# Altium project PCB-Tester-Board-V1.PrjPcb (part 4 of 4)

## Sheet PowerRouting.SchDoc: PCB-Tester Power Routing
size A4; Date: JUN 2020; CheckedBy: Moerz, Hoeren; Author: Rudziński; CompanyName: TDK-Micronas GmbH; DrawnBy: Rudziński; Engineer: Rudziński; Organization: Test Engineering; Address1: Hans-Bunte-Strasse 19; Address2: D-79108 Freiburg; Address3: Germany; DocumentNumber: U33110; Revision: V1.0; SheetNumber: 16; SheetTotal: 18; DateDraw: JUN 2020; DateChecked: 2020-06-19; Workspace: Workspace; TitleTyp: Title-Typ; PageSetup: Record=PageOptions|CenterHorizontal=True|CenterVertical=True|PrintScale=0.97|XCorrection=1.00|YCorrection=1.00|PrintKind=0|BorderSize=5000000|LeftOffset=0|BottomOffset=0|Orientation=2|PaperLength=1000|PaperWidth=1000|Scale=100|PaperSource=7|PrintQuality=-3|MediaType=1|DitherType=10|PrintScaleMode=1|PaperKind=A4|PaperIndex=9
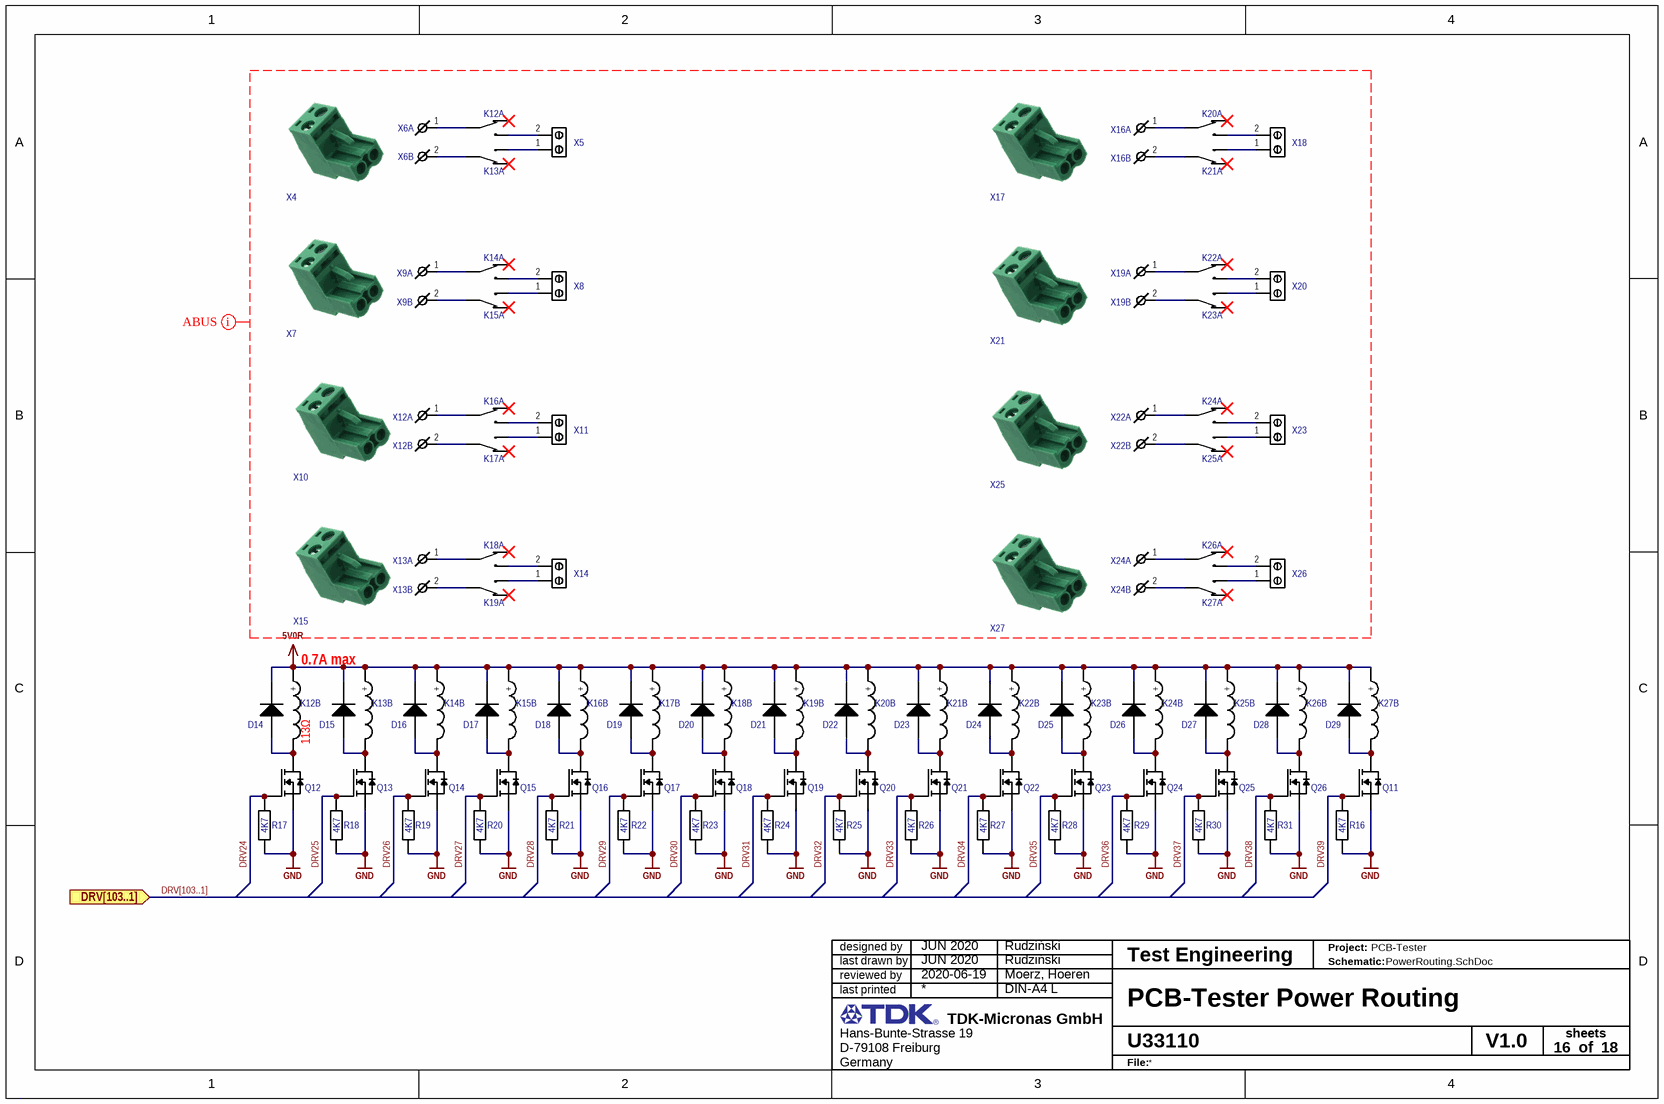
[diagram p16: PowerRouting.SchDoc]

### Parts
D14  D  [SOD123]  (value not drawn)
D15  D  [SOD123]  (value not drawn)
D16  D  [SOD123]  (value not drawn)
D17  D  [SOD123]  (value not drawn)
D18  D  [SOD123]  (value not drawn)
D19  D  [SOD123]  (value not drawn)
D20  D  [SOD123]  (value not drawn)
D21  D  [SOD123]  (value not drawn)
D22  D  [SOD123]  (value not drawn)
D23  D  [SOD123]  (value not drawn)
D24  D  [SOD123]  (value not drawn)
D25  D  [SOD123]  (value not drawn)
D26  D  [SOD123]  (value not drawn)
D27  D  [SOD123]  (value not drawn)
D28  D  [SOD123]  (value not drawn)
D29  D  [SOD123]  (value not drawn)
K12  K  [HF118F005-1ZS1]  (value not drawn)  (parts A,B of 2)
K13  K  [HF118F005-1ZS1]  (value not drawn)  (parts A,B of 2)
K14  K  [HF118F005-1ZS1]  (value not drawn)  (parts A,B of 2)
K15  K  [HF118F005-1ZS1]  (value not drawn)  (parts A,B of 2)
K16  K  [HF118F005-1ZS1]  (value not drawn)  (parts A,B of 2)
K17  K  [HF118F005-1ZS1]  (value not drawn)  (parts A,B of 2)
K18  K  [HF118F005-1ZS1]  (value not drawn)  (parts A,B of 2)
K19  K  [HF118F005-1ZS1]  (value not drawn)  (parts A,B of 2)
K20  K  [HF118F005-1ZS1]  (value not drawn)  (parts A,B of 2)
K21  K  [HF118F005-1ZS1]  (value not drawn)  (parts A,B of 2)
K22  K  [HF118F005-1ZS1]  (value not drawn)  (parts A,B of 2)
K23  K  [HF118F005-1ZS1]  (value not drawn)  (parts A,B of 2)
K24  K  [HF118F005-1ZS1]  (value not drawn)  (parts A,B of 2)
K25  K  [HF118F005-1ZS1]  (value not drawn)  (parts A,B of 2)
K26  K  [HF118F005-1ZS1]  (value not drawn)  (parts A,B of 2)
K27  K  [HF118F005-1ZS1]  (value not drawn)  (parts A,B of 2)
Q11  Q  [SOT23-3]  (value not drawn)
Q12  Q  [SOT23-3]  (value not drawn)
Q13  Q  [SOT23-3]  (value not drawn)
Q14  Q  [SOT23-3]  (value not drawn)
Q15  Q  [SOT23-3]  (value not drawn)
Q16  Q  [SOT23-3]  (value not drawn)
Q17  Q  [SOT23-3]  (value not drawn)
Q18  Q  [SOT23-3]  (value not drawn)
Q19  Q  [SOT23-3]  (value not drawn)
Q20  Q  [SOT23-3]  (value not drawn)
Q21  Q  [SOT23-3]  (value not drawn)
Q22  Q  [SOT23-3]  (value not drawn)
Q23  Q  [SOT23-3]  (value not drawn)
Q24  Q  [SOT23-3]  (value not drawn)
Q25  Q  [SOT23-3]  (value not drawn)
Q26  Q  [SOT23-3]  (value not drawn)
R16  value 4K7  [R0603 Reflow]  (hidden comment: R)
R17  value 4K7  [R0603 Reflow]  (hidden comment: R)
R18  value 4K7  [R0603 Reflow]  (hidden comment: R)
R19  value 4K7  [R0603 Reflow]  (hidden comment: R)
R20  value 4K7  [R0603 Reflow]  (hidden comment: R)
R21  value 4K7  [R0603 Reflow]  (hidden comment: R)
R22  value 4K7  [R0603 Reflow]  (hidden comment: R)
R23  value 4K7  [R0603 Reflow]  (hidden comment: R)
R24  value 4K7  [R0603 Reflow]  (hidden comment: R)
R25  value 4K7  [R0603 Reflow]  (hidden comment: R)
R26  value 4K7  [R0603 Reflow]  (hidden comment: R)
R27  value 4K7  [R0603 Reflow]  (hidden comment: R)
R28  value 4K7  [R0603 Reflow]  (hidden comment: R)
R29  value 4K7  [R0603 Reflow]  (hidden comment: R)
R30  value 4K7  [R0603 Reflow]  (hidden comment: R)
R31  value 4K7  [R0603 Reflow]  (hidden comment: R)
X4  X  [691352710002]  (value not drawn)
X5  X  [1731721]  (value not drawn)
X6  X  [691312710002]  (value not drawn)  (parts A,B of 2)
X7  X  [691352710002]  (value not drawn)
X8  X  [1731721]  (value not drawn)
X9  X  [691312710002]  (value not drawn)  (parts A,B of 2)
X10  X  [691352710002]  (value not drawn)
X11  X  [1731721]  (value not drawn)
X12  X  [691312710002]  (value not drawn)  (parts A,B of 2)
X13  X  [691312710002]  (value not drawn)  (parts A,B of 2)
X14  X  [1731721]  (value not drawn)
X15  X  [691352710002]  (value not drawn)
X16  X  [691312710002]  (value not drawn)  (parts A,B of 2)
X17  X  [691352710002]  (value not drawn)
X18  X  [1731721]  (value not drawn)
X19  X  [691312710002]  (value not drawn)  (parts A,B of 2)
X20  X  [1731721]  (value not drawn)
X21  X  [691352710002]  (value not drawn)
X22  X  [691312710002]  (value not drawn)  (parts A,B of 2)
X23  X  [1731721]  (value not drawn)
X24  X  [691312710002]  (value not drawn)  (parts A,B of 2)
X25  X  [691352710002]  (value not drawn)
X26  X  [1731721]  (value not drawn)
X27  X  [691352710002]  (value not drawn)

### Ports
DRV[103..1] (in)

### Nets
5V0R: D14.2(C) D15.2(C) D16.2(C) D17.2(C) D18.2(C) D19.2(C) D20.2(C) D21.2(C) D22.2(C) D23.2(C) D24.2(C) D25.2(C) D26.2(C) D27.2(C) D28.2(C) D29.2(C) K12.1(+) K13.1(+) K14.1(+) K15.1(+) K16.1(+) K17.1(+) K18.1(+) K19.1(+) K20.1(+) K21.1(+) K22.1(+) K23.1(+) K24.1(+) K25.1(+) K26.1(+) K27.1(+)
GND: Q11.2(S) Q12.2(S) Q13.2(S) Q14.2(S) Q15.2(S) Q16.2(S) Q17.2(S) Q18.2(S) Q19.2(S) Q20.2(S) Q21.2(S) Q22.2(S) Q23.2(S) Q24.2(S) Q25.2(S) Q26.2(S) R16.1 R17.1 R18.1 R19.1 R20.1 R21.1 R22.1 R23.1 R24.1 R25.1 R26.1 R27.1 R28.1 R29.1 R30.1 R31.1
DRV24: Q12.1(G) R17.2
DRV25: Q13.1(G) R18.2
DRV26: Q14.1(G) R19.2
DRV27: Q15.1(G) R20.2
DRV28: Q16.1(G) R21.2
DRV29: Q17.1(G) R22.2
DRV30: Q18.1(G) R23.2
DRV31: Q19.1(G) R24.2
DRV32: Q20.1(G) R25.2
DRV33: Q21.1(G) R26.2
DRV34: Q22.1(G) R27.2
DRV35: Q23.1(G) R28.2
DRV36: Q24.1(G) R29.2
DRV37: Q25.1(G) R30.2
DRV38: Q26.1(G) R31.2
DRV39: Q11.1(G) R16.2
NetD14_1: D14.1(A) K12.5(-) Q12.3(D)
NetD15_1: D15.1(A) K13.5(-) Q13.3(D)
NetD16_1: D16.1(A) K14.5(-) Q14.3(D)
NetD17_1: D17.1(A) K15.5(-) Q15.3(D)
NetD18_1: D18.1(A) K16.5(-) Q16.3(D)
NetD19_1: D19.1(A) K17.5(-) Q17.3(D)
NetD20_1: D20.1(A) K18.5(-) Q18.3(D)
NetD21_1: D21.1(A) K19.5(-) Q19.3(D)
NetD22_1: D22.1(A) K20.5(-) Q20.3(D)
NetD23_1: D23.1(A) K21.5(-) Q21.3(D)
NetD24_1: D24.1(A) K22.5(-) Q22.3(D)
NetD25_1: D25.1(A) K23.5(-) Q23.3(D)
NetD26_1: D26.1(A) K24.5(-) Q24.3(D)
NetD27_1: D27.1(A) K25.5(-) Q25.3(D)
NetD28_1: D28.1(A) K26.5(-) Q26.3(D)
NetD29_1: D29.1(A) K27.5(-) Q11.3(D)
NetK12_2: K12.2(Cin) X6.1(+)
NetK12_3: K12.3(Cno) X5.2
NetK13_2: K13.2(Cin) X6.2(-)
NetK13_3: K13.3(Cno) X5.1
NetK14_2: K14.2(Cin) X9.1(+)
NetK14_3: K14.3(Cno) X8.2
NetK15_2: K15.2(Cin) X9.2(-)
NetK15_3: K15.3(Cno) X8.1
NetK16_2: K16.2(Cin) X12.1(+)
NetK16_3: K16.3(Cno) X11.2
NetK17_2: K17.2(Cin) X12.2(-)
NetK17_3: K17.3(Cno) X11.1
NetK18_2: K18.2(Cin) X13.1(+)
NetK18_3: K18.3(Cno) X14.2
NetK19_2: K19.2(Cin) X13.2(-)
NetK19_3: K19.3(Cno) X14.1
NetK20_2: K20.2(Cin) X16.1(+)
NetK20_3: K20.3(Cno) X18.2
NetK21_2: K21.2(Cin) X16.2(-)
NetK21_3: K21.3(Cno) X18.1
NetK22_2: K22.2(Cin) X19.1(+)
NetK22_3: K22.3(Cno) X20.2
NetK23_2: K23.2(Cin) X19.2(-)
NetK23_3: K23.3(Cno) X20.1
NetK24_2: K24.2(Cin) X22.1(+)
NetK24_3: K24.3(Cno) X23.2
NetK25_2: K25.2(Cin) X22.2(-)
NetK25_3: K25.3(Cno) X23.1
NetK26_2: K26.2(Cin) X24.1(+)
NetK26_3: K26.3(Cno) X26.2
NetK27_2: K27.2(Cin) X24.2(-)
NetK27_3: K27.3(Cno) X26.1

Not connected (* = marked no-connect by the designer): K12 4(Cnc)*; K13 4(Cnc)*; K14 4(Cnc)*; K15 4(Cnc)*; K16 4(Cnc)*; K17 4(Cnc)*; K18 4(Cnc)*; K19 4(Cnc)*; K20 4(Cnc)*; K21 4(Cnc)*; K22 4(Cnc)*; K23 4(Cnc)*; K24 4(Cnc)*; K25 4(Cnc)*; K26 4(Cnc)*; K27 4(Cnc)*

### Buses and harness runs
bus DRV[103..1] = port DRV[103..1]

### Layout directives
net class ABUS: (no net found under the mark)

### Notes on the sheet
- 0.7A max
- designed by
- reviewed by
- last drawn by
- Project:
- Schematic:
- last printed
- DIN-A4 L
- sheets
- of
- File:

### Library data of the parts
D14-D29 = 1N4148W: DIODE GEN PURP 100V 300MA SOD123; 04. Manufacturer: Diodes Incorporated; 07. Manufacturer  Part Number: 1N4148W-7-F; 03. Unit Price: 0.14; 01. Distributor: DigiKey; 02. Distributor Part Number: 1N4148W-FDICT-ND; 11. RoHS: YES; ComponentLink1Description: Info; ComponentLink1URL: https://www.digikey.de/product-detail/en/nexperia-usa-inc/PMEG4050EP115/1727-5842-6-ND/2697559; ComponentLink2Description: DataSheet; ComponentLink2URL: https://assets.nexperia.com/documents/data-sheet/PMEG4050EP.pdf
K12-K27 = HF118F005-1ZS1: 5V Power Relay, switch over; 04. Manufacturer: Hongfa Europe GMBH; 07. Manufacturer  Part Number: HF118F/005-1ZS1T(136); 03. Unit Price: 2.60; 13. Created Date/Name: AUG2018/Hören; Coil Resistance: 113Ω; Max Carry Current: 10A; Max Switch Voltage: 440Vac/125Vdc; Power Rating: 300Wdc/2.5KVAac; 01. Distributor: RS-Components; 02. Distributor Part Number: 176-2821; 09. Operating Temperature: -xx..+yy°C; 11. RoHS: YES; ComponentLink1Description: Info; ComponentLink1URL: https://de.rs-online.com/web/p/monostabile-relais/1762821/; ComponentLink2Description: DataSheet; ComponentLink2URL: https://docs.rs-online.com/c37d/0900766b81663e9a.pdf; Coil Voltage: 5V; Max Switch Current: 10A
Q11-Q26 = FDV303N: MOSFET N-CH 25V 680MA SOT-23; 04. Manufacturer: ON Semiconductor; 03. Unit Price: 0.41; 13. Created Date/Name: AUG 2018 / Hören; Rds On: 450 mΩ @ id=500mA & Vgs=4.5V; Vgs,th: 1.5V @ 250uA; Power Rating: 350mW; 3D-Export: No; 01. Distributor: DigiKey; 02. Distributor Part Number: FDV303NDKR-ND; 07. Manufacturer  Part Number: FDV303N; 09. Operating Temperature: -55°C ~ 150°C (TJ); 11. RoHS: YES; ComponentLink1Description: Info; ComponentLink1URL: https://www.digikey.de/product-detail/en/on-semiconductor/FDV303N/FDV303NDKR-ND/1630434; ComponentLink2Description: DataSheet; ComponentLink2URL: https://media.digikey.com/pdf/Data%20Sheets/Fairchild%20PDFs/FDV303N.pdf; Vdss: 25V; Id: 680mA
R16-R31 = R: RES SMD 4.7K OHM 1% 1/10W 0603; 04. Manufacturer: Yageo; 07. Manufacturer  Part Number: RC0603FR-074K7L; 03. Unit Price: 0.09; 13. Created Date/Name: AUG2018/Hören; Tolerance: ±1%; ComponentLink1URL: *; ComponentLink1Description: Info; 02. Distributor Part Number: 311-4.70KHRCT-ND; 09. Operating Temperature: -xx..+yy°C; 11. RoHS: ???; 01. Distributor: DigiKey; ComponentLink2Description: DataSheet; Package: *
X4 X7 X10 X15 X17 X21 X25 X27 = 691352710002: TERM BLOCK PLUG 2POS STR 5MM; 04. Manufacturer: Würth Elektronik; 03. Unit Price: 1.1; 13. Created Date/Name: ??? / Hören; System: Connector; 01. Distributor: DigiKey; 02. Distributor Part Number: 732-2775-ND; 07. Manufacturer  Part Number: 691352710002; ComponentLink1Description: Info; ComponentLink1URL: https://www.digikey.de/products/en?keywords=691352710002; ComponentLink2Description: DataSheet; ComponentLink2URL: https://www.we-online.de/katalog/datasheet/6913527100xx.pdf
X5 X8 X11 X14 X18 X20 X23 X26 = 1731721: TERM BLK 2P SIDE ENT 7.62MM PCB; 04. Manufacturer: Phoenix Contact; 03. Unit Price: 2.12; 13. Created Date/Name: JAN 2019 / Hören; System: Connector; 01. Distributor: DigiKey; 02. Distributor Part Number: 277-5849-ND; 07. Manufacturer  Part Number: 1731721; 11. RoHS: YES; ComponentLink1Description: Info; ComponentLink1URL: https://www.digikey.de/products/en?keywords=1731721; ComponentLink2Description: DataSheet; ComponentLink2URL: https://media.digikey.com/pdf/Data%20Sheets/Phoenix%20Contact%20PDFs/1731721.pdf
X6 X9 X12 X13 X16 X19 X22 X24 = 691312710002: TERM BLOCK HDR 2POS 90DEG 5MM; 04. Manufacturer: Würth Elektronik; 03. Unit Price: 0.244; 13. Created Date/Name: ??? / Hören; System: Connector; 01. Distributor: DigiKey; 02. Distributor Part Number: 732-2805-ND; 07. Manufacturer  Part Number: 691312710002; ComponentLink1Description: Info; ComponentLink2Description: DataSheet

## Sheet SignalRouting.SchDoc: PCB-Tester Signal Routing
size A3 portrait; Date: JUN 2020; CheckedBy: Moerz, Hoeren; Author: Rudziński; CompanyName: TDK-Micronas GmbH; DrawnBy: Rudziński; Engineer: Rudziński; Organization: Test Engineering; Address1: Hans-Bunte-Strasse 19; Address2: D-79108 Freiburg; Address3: Germany; DocumentNumber: U33110; Revision: V1.0; SheetNumber: 18; SheetTotal: 18; DateDraw: JUN 2020; DateChecked: 2020-06-19; Workspace: Workspace; TitleTyp: Title-Typ; PageSetup: Record=PageOptions|CenterHorizontal=True|CenterVertical=True|PrintScale=0.97|XCorrection=1.00|YCorrection=1.00|PrintKind=0|BorderSize=5000000|LeftOffset=0|BottomOffset=0|Orientation=2|PaperLength=1000|PaperWidth=1000|Scale=100|PaperSource=7|PrintQuality=-3|MediaType=1|DitherType=10|PrintScaleMode=1|PaperKind=A4|PaperIndex=9
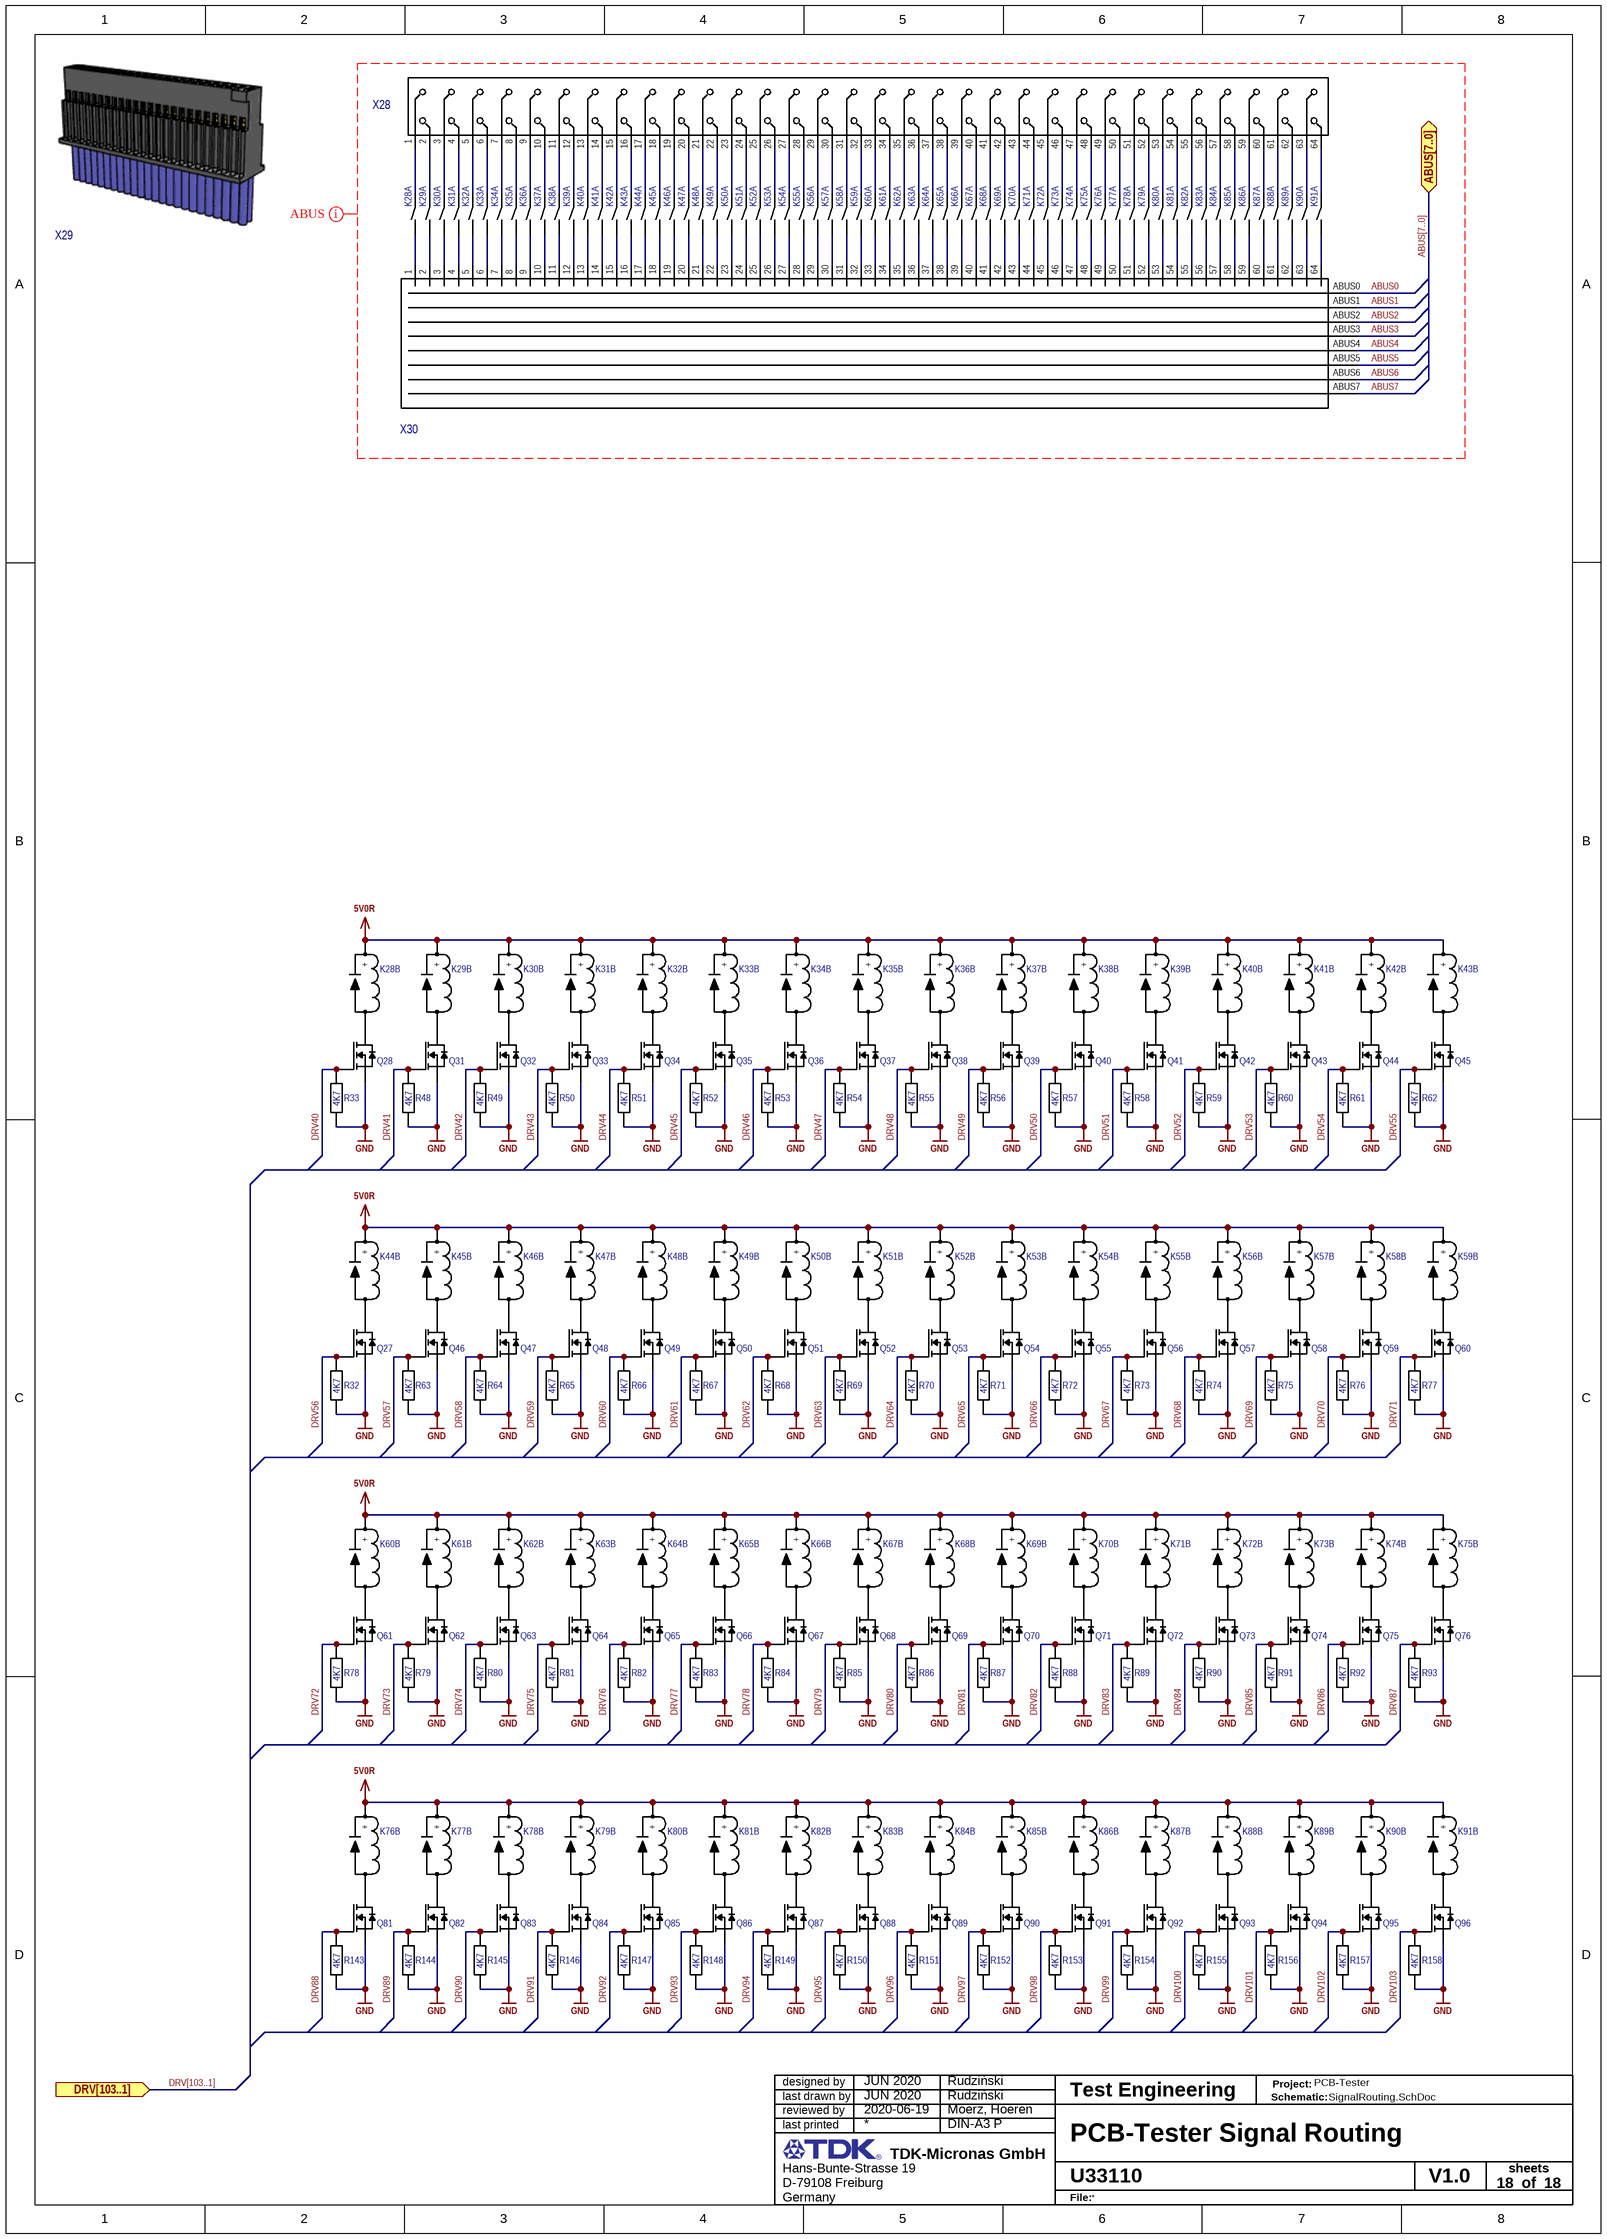
[diagram p17: SignalRouting.SchDoc]

### Parts
K28  K  [118-1A]  (value not drawn)  (parts A,B of 2)
K29  K  [118-1A]  (value not drawn)  (parts A,B of 2)
K30  K  [118-1A]  (value not drawn)  (parts A,B of 2)
K31  K  [118-1A]  (value not drawn)  (parts A,B of 2)
K32  K  [118-1A]  (value not drawn)  (parts A,B of 2)
K33  K  [118-1A]  (value not drawn)  (parts A,B of 2)
K34  K  [118-1A]  (value not drawn)  (parts A,B of 2)
K35  K  [118-1A]  (value not drawn)  (parts A,B of 2)
K36  K  [118-1A]  (value not drawn)  (parts A,B of 2)
K37  K  [118-1A]  (value not drawn)  (parts A,B of 2)
K38  K  [118-1A]  (value not drawn)  (parts A,B of 2)
K39  K  [118-1A]  (value not drawn)  (parts A,B of 2)
K40  K  [118-1A]  (value not drawn)  (parts A,B of 2)
K41  K  [118-1A]  (value not drawn)  (parts A,B of 2)
K42  K  [118-1A]  (value not drawn)  (parts A,B of 2)
K43  K  [118-1A]  (value not drawn)  (parts A,B of 2)
K44  K  [118-1A]  (value not drawn)  (parts A,B of 2)
K45  K  [118-1A]  (value not drawn)  (parts A,B of 2)
K46  K  [118-1A]  (value not drawn)  (parts A,B of 2)
K47  K  [118-1A]  (value not drawn)  (parts A,B of 2)
K48  K  [118-1A]  (value not drawn)  (parts A,B of 2)
K49  K  [118-1A]  (value not drawn)  (parts A,B of 2)
K50  K  [118-1A]  (value not drawn)  (parts A,B of 2)
K51  K  [118-1A]  (value not drawn)  (parts A,B of 2)
K52  K  [118-1A]  (value not drawn)  (parts A,B of 2)
K53  K  [118-1A]  (value not drawn)  (parts A,B of 2)
K54  K  [118-1A]  (value not drawn)  (parts A,B of 2)
K55  K  [118-1A]  (value not drawn)  (parts A,B of 2)
K56  K  [118-1A]  (value not drawn)  (parts A,B of 2)
K57  K  [118-1A]  (value not drawn)  (parts A,B of 2)
K58  K  [118-1A]  (value not drawn)  (parts A,B of 2)
K59  K  [118-1A]  (value not drawn)  (parts A,B of 2)
K60  K  [118-1A]  (value not drawn)  (parts A,B of 2)
K61  K  [118-1A]  (value not drawn)  (parts A,B of 2)
K62  K  [118-1A]  (value not drawn)  (parts A,B of 2)
K63  K  [118-1A]  (value not drawn)  (parts A,B of 2)
K64  K  [118-1A]  (value not drawn)  (parts A,B of 2)
K65  K  [118-1A]  (value not drawn)  (parts A,B of 2)
K66  K  [118-1A]  (value not drawn)  (parts A,B of 2)
K67  K  [118-1A]  (value not drawn)  (parts A,B of 2)
K68  K  [118-1A]  (value not drawn)  (parts A,B of 2)
K69  K  [118-1A]  (value not drawn)  (parts A,B of 2)
K70  K  [118-1A]  (value not drawn)  (parts A,B of 2)
K71  K  [118-1A]  (value not drawn)  (parts A,B of 2)
K72  K  [118-1A]  (value not drawn)  (parts A,B of 2)
K73  K  [118-1A]  (value not drawn)  (parts A,B of 2)
K74  K  [118-1A]  (value not drawn)  (parts A,B of 2)
K75  K  [118-1A]  (value not drawn)  (parts A,B of 2)
K76  K  [118-1A]  (value not drawn)  (parts A,B of 2)
K77  K  [118-1A]  (value not drawn)  (parts A,B of 2)
K78  K  [118-1A]  (value not drawn)  (parts A,B of 2)
K79  K  [118-1A]  (value not drawn)  (parts A,B of 2)
K80  K  [118-1A]  (value not drawn)  (parts A,B of 2)
K81  K  [118-1A]  (value not drawn)  (parts A,B of 2)
K82  K  [118-1A]  (value not drawn)  (parts A,B of 2)
K83  K  [118-1A]  (value not drawn)  (parts A,B of 2)
K84  K  [118-1A]  (value not drawn)  (parts A,B of 2)
K85  K  [118-1A]  (value not drawn)  (parts A,B of 2)
K86  K  [118-1A]  (value not drawn)  (parts A,B of 2)
K87  K  [118-1A]  (value not drawn)  (parts A,B of 2)
K88  K  [118-1A]  (value not drawn)  (parts A,B of 2)
K89  K  [118-1A]  (value not drawn)  (parts A,B of 2)
K90  K  [118-1A]  (value not drawn)  (parts A,B of 2)
K91  K  [118-1A]  (value not drawn)  (parts A,B of 2)
Q27  Q  [SOT23-3]  (value not drawn)
Q28  Q  [SOT23-3]  (value not drawn)
Q31  Q  [SOT23-3]  (value not drawn)
Q32  Q  [SOT23-3]  (value not drawn)
Q33  Q  [SOT23-3]  (value not drawn)
Q34  Q  [SOT23-3]  (value not drawn)
Q35  Q  [SOT23-3]  (value not drawn)
Q36  Q  [SOT23-3]  (value not drawn)
Q37  Q  [SOT23-3]  (value not drawn)
Q38  Q  [SOT23-3]  (value not drawn)
Q39  Q  [SOT23-3]  (value not drawn)
Q40  Q  [SOT23-3]  (value not drawn)
Q41  Q  [SOT23-3]  (value not drawn)
Q42  Q  [SOT23-3]  (value not drawn)
Q43  Q  [SOT23-3]  (value not drawn)
Q44  Q  [SOT23-3]  (value not drawn)
Q45  Q  [SOT23-3]  (value not drawn)
Q46  Q  [SOT23-3]  (value not drawn)
Q47  Q  [SOT23-3]  (value not drawn)
Q48  Q  [SOT23-3]  (value not drawn)
Q49  Q  [SOT23-3]  (value not drawn)
Q50  Q  [SOT23-3]  (value not drawn)
Q51  Q  [SOT23-3]  (value not drawn)
Q52  Q  [SOT23-3]  (value not drawn)
Q53  Q  [SOT23-3]  (value not drawn)
Q54  Q  [SOT23-3]  (value not drawn)
Q55  Q  [SOT23-3]  (value not drawn)
Q56  Q  [SOT23-3]  (value not drawn)
Q57  Q  [SOT23-3]  (value not drawn)
Q58  Q  [SOT23-3]  (value not drawn)
Q59  Q  [SOT23-3]  (value not drawn)
Q60  Q  [SOT23-3]  (value not drawn)
Q61  Q  [SOT23-3]  (value not drawn)
Q62  Q  [SOT23-3]  (value not drawn)
Q63  Q  [SOT23-3]  (value not drawn)
Q64  Q  [SOT23-3]  (value not drawn)
Q65  Q  [SOT23-3]  (value not drawn)
Q66  Q  [SOT23-3]  (value not drawn)
Q67  Q  [SOT23-3]  (value not drawn)
Q68  Q  [SOT23-3]  (value not drawn)
Q69  Q  [SOT23-3]  (value not drawn)
Q70  Q  [SOT23-3]  (value not drawn)
Q71  Q  [SOT23-3]  (value not drawn)
Q72  Q  [SOT23-3]  (value not drawn)
Q73  Q  [SOT23-3]  (value not drawn)
Q74  Q  [SOT23-3]  (value not drawn)
Q75  Q  [SOT23-3]  (value not drawn)
Q76  Q  [SOT23-3]  (value not drawn)
Q81  Q  [SOT23-3]  (value not drawn)
Q82  Q  [SOT23-3]  (value not drawn)
Q83  Q  [SOT23-3]  (value not drawn)
Q84  Q  [SOT23-3]  (value not drawn)
Q85  Q  [SOT23-3]  (value not drawn)
Q86  Q  [SOT23-3]  (value not drawn)
Q87  Q  [SOT23-3]  (value not drawn)
Q88  Q  [SOT23-3]  (value not drawn)
Q89  Q  [SOT23-3]  (value not drawn)
Q90  Q  [SOT23-3]  (value not drawn)
Q91  Q  [SOT23-3]  (value not drawn)
Q92  Q  [SOT23-3]  (value not drawn)
Q93  Q  [SOT23-3]  (value not drawn)
Q94  Q  [SOT23-3]  (value not drawn)
Q95  Q  [SOT23-3]  (value not drawn)
Q96  Q  [SOT23-3]  (value not drawn)
R32  value 4K7  [R0603 Reflow]  (hidden comment: R)
R33  value 4K7  [R0603 Reflow]  (hidden comment: R)
R48  value 4K7  [R0603 Reflow]  (hidden comment: R)
R49  value 4K7  [R0603 Reflow]  (hidden comment: R)
R50  value 4K7  [R0603 Reflow]  (hidden comment: R)
R51  value 4K7  [R0603 Reflow]  (hidden comment: R)
R52  value 4K7  [R0603 Reflow]  (hidden comment: R)
R53  value 4K7  [R0603 Reflow]  (hidden comment: R)
R54  value 4K7  [R0603 Reflow]  (hidden comment: R)
R55  value 4K7  [R0603 Reflow]  (hidden comment: R)
R56  value 4K7  [R0603 Reflow]  (hidden comment: R)
R57  value 4K7  [R0603 Reflow]  (hidden comment: R)
R58  value 4K7  [R0603 Reflow]  (hidden comment: R)
R59  value 4K7  [R0603 Reflow]  (hidden comment: R)
R60  value 4K7  [R0603 Reflow]  (hidden comment: R)
R61  value 4K7  [R0603 Reflow]  (hidden comment: R)
R62  value 4K7  [R0603 Reflow]  (hidden comment: R)
R63  value 4K7  [R0603 Reflow]  (hidden comment: R)
R64  value 4K7  [R0603 Reflow]  (hidden comment: R)
R65  value 4K7  [R0603 Reflow]  (hidden comment: R)
R66  value 4K7  [R0603 Reflow]  (hidden comment: R)
R67  value 4K7  [R0603 Reflow]  (hidden comment: R)
R68  value 4K7  [R0603 Reflow]  (hidden comment: R)
R69  value 4K7  [R0603 Reflow]  (hidden comment: R)
R70  value 4K7  [R0603 Reflow]  (hidden comment: R)
R71  value 4K7  [R0603 Reflow]  (hidden comment: R)
R72  value 4K7  [R0603 Reflow]  (hidden comment: R)
R73  value 4K7  [R0603 Reflow]  (hidden comment: R)
R74  value 4K7  [R0603 Reflow]  (hidden comment: R)
R75  value 4K7  [R0603 Reflow]  (hidden comment: R)
R76  value 4K7  [R0603 Reflow]  (hidden comment: R)
R77  value 4K7  [R0603 Reflow]  (hidden comment: R)
R78  value 4K7  [R0603 Reflow]  (hidden comment: R)
R79  value 4K7  [R0603 Reflow]  (hidden comment: R)
R80  value 4K7  [R0603 Reflow]  (hidden comment: R)
R81  value 4K7  [R0603 Reflow]  (hidden comment: R)
R82  value 4K7  [R0603 Reflow]  (hidden comment: R)
R83  value 4K7  [R0603 Reflow]  (hidden comment: R)
R84  value 4K7  [R0603 Reflow]  (hidden comment: R)
R85  value 4K7  [R0603 Reflow]  (hidden comment: R)
R86  value 4K7  [R0603 Reflow]  (hidden comment: R)
R87  value 4K7  [R0603 Reflow]  (hidden comment: R)
R88  value 4K7  [R0603 Reflow]  (hidden comment: R)
R89  value 4K7  [R0603 Reflow]  (hidden comment: R)
R90  value 4K7  [R0603 Reflow]  (hidden comment: R)
R91  value 4K7  [R0603 Reflow]  (hidden comment: R)
R92  value 4K7  [R0603 Reflow]  (hidden comment: R)
R93  value 4K7  [R0603 Reflow]  (hidden comment: R)
R143  value 4K7  [R0603 Reflow]  (hidden comment: R)
R144  value 4K7  [R0603 Reflow]  (hidden comment: R)
R145  value 4K7  [R0603 Reflow]  (hidden comment: R)
R146  value 4K7  [R0603 Reflow]  (hidden comment: R)
R147  value 4K7  [R0603 Reflow]  (hidden comment: R)
R148  value 4K7  [R0603 Reflow]  (hidden comment: R)
R149  value 4K7  [R0603 Reflow]  (hidden comment: R)
R150  value 4K7  [R0603 Reflow]  (hidden comment: R)
R151  value 4K7  [R0603 Reflow]  (hidden comment: R)
R152  value 4K7  [R0603 Reflow]  (hidden comment: R)
R153  value 4K7  [R0603 Reflow]  (hidden comment: R)
R154  value 4K7  [R0603 Reflow]  (hidden comment: R)
R155  value 4K7  [R0603 Reflow]  (hidden comment: R)
R156  value 4K7  [R0603 Reflow]  (hidden comment: R)
R157  value 4K7  [R0603 Reflow]  (hidden comment: R)
R158  value 4K7  [R0603 Reflow]  (hidden comment: R)
X28  X  [TFC-132-01-F-D-LA]  (value not drawn)
X29  X  (value not drawn)
X30  X  [CONFIG64]  (value not drawn)  (no BOM)

### Ports
ABUS[7..0] (bidir), DRV[103..1] (in)

### Nets
5V0R: K28.1(+) K29.1(+) K30.1(+) K31.1(+) K32.1(+) K33.1(+) K34.1(+) K35.1(+) K36.1(+) K37.1(+) K38.1(+) K39.1(+) K40.1(+) K41.1(+) K42.1(+) K43.1(+) K44.1(+) K45.1(+) K46.1(+) K47.1(+) K48.1(+) K49.1(+) K50.1(+) K51.1(+) K52.1(+) K53.1(+) K54.1(+) K55.1(+) K56.1(+) K57.1(+) K58.1(+) K59.1(+) K60.1(+) K61.1(+) K62.1(+) K63.1(+) K64.1(+) K65.1(+) K66.1(+) K67.1(+) K68.1(+) K69.1(+) K70.1(+) K71.1(+) K72.1(+) K73.1(+) K74.1(+) K75.1(+) K76.1(+) K77.1(+) K78.1(+) K79.1(+) K80.1(+) K81.1(+) K82.1(+) K83.1(+) K84.1(+) K85.1(+) K86.1(+) K87.1(+) K88.1(+) K89.1(+) K90.1(+) K91.1(+)
GND: Q27.2(S) Q28.2(S) Q31.2(S) Q32.2(S) Q33.2(S) Q34.2(S) Q35.2(S) Q36.2(S) Q37.2(S) Q38.2(S) Q39.2(S) Q40.2(S) Q41.2(S) Q42.2(S) Q43.2(S) Q44.2(S) Q45.2(S) Q46.2(S) Q47.2(S) Q48.2(S) Q49.2(S) Q50.2(S) Q51.2(S) Q52.2(S) Q53.2(S) Q54.2(S) Q55.2(S) Q56.2(S) Q57.2(S) Q58.2(S) Q59.2(S) Q60.2(S) Q61.2(S) Q62.2(S) Q63.2(S) Q64.2(S) Q65.2(S) Q66.2(S) Q67.2(S) Q68.2(S) Q69.2(S) Q70.2(S) Q71.2(S) Q72.2(S) Q73.2(S) Q74.2(S) Q75.2(S) Q76.2(S) Q81.2(S) Q82.2(S) Q83.2(S) Q84.2(S) Q85.2(S) Q86.2(S) Q87.2(S) Q88.2(S) Q89.2(S) Q90.2(S) Q91.2(S) Q92.2(S) Q93.2(S) Q94.2(S) Q95.2(S) Q96.2(S) R32.1 R33.1 R48.1 R49.1 R50.1 R51.1 R52.1 R53.1 R54.1 R55.1 R56.1 R57.1 R58.1 R59.1 R60.1 R61.1 R62.1 R63.1 R64.1 R65.1 R66.1 R67.1 R68.1 R69.1 R70.1 R71.1 R72.1 R73.1 R74.1 R75.1 R76.1 R77.1 R78.1 R79.1 R80.1 R81.1 R82.1 R83.1 R84.1 R85.1 R86.1 R87.1 R88.1 R89.1 R90.1 R91.1 R92.1 R93.1 R143.1 R144.1 R145.1 R146.1 R147.1 R148.1 R149.1 R150.1 R151.1 R152.1 R153.1 R154.1 R155.1 R156.1 R157.1 R158.1
ABUS0: X30.ABUS0
ABUS1: X30.ABUS1
ABUS2: X30.ABUS2
ABUS3: X30.ABUS3
ABUS4: X30.ABUS4
ABUS5: X30.ABUS5
ABUS6: X30.ABUS6
ABUS7: X30.ABUS7
DRV40: Q28.1(G) R33.2
DRV41: Q31.1(G) R48.2
DRV42: Q32.1(G) R49.2
DRV43: Q33.1(G) R50.2
DRV44: Q34.1(G) R51.2
DRV45: Q35.1(G) R52.2
DRV46: Q36.1(G) R53.2
DRV47: Q37.1(G) R54.2
DRV48: Q38.1(G) R55.2
DRV49: Q39.1(G) R56.2
DRV50: Q40.1(G) R57.2
DRV51: Q41.1(G) R58.2
DRV52: Q42.1(G) R59.2
DRV53: Q43.1(G) R60.2
DRV54: Q44.1(G) R61.2
DRV55: Q45.1(G) R62.2
DRV56: Q27.1(G) R32.2
DRV57: Q46.1(G) R63.2
DRV58: Q47.1(G) R64.2
DRV59: Q48.1(G) R65.2
DRV60: Q49.1(G) R66.2
DRV61: Q50.1(G) R67.2
DRV62: Q51.1(G) R68.2
DRV63: Q52.1(G) R69.2
DRV64: Q53.1(G) R70.2
DRV65: Q54.1(G) R71.2
DRV66: Q55.1(G) R72.2
DRV67: Q56.1(G) R73.2
DRV68: Q57.1(G) R74.2
DRV69: Q58.1(G) R75.2
DRV70: Q59.1(G) R76.2
DRV71: Q60.1(G) R77.2
DRV72: Q61.1(G) R78.2
DRV73: Q62.1(G) R79.2
DRV74: Q63.1(G) R80.2
DRV75: Q64.1(G) R81.2
DRV76: Q65.1(G) R82.2
DRV77: Q66.1(G) R83.2
DRV78: Q67.1(G) R84.2
DRV79: Q68.1(G) R85.2
DRV80: Q69.1(G) R86.2
DRV81: Q70.1(G) R87.2
DRV82: Q71.1(G) R88.2
DRV83: Q72.1(G) R89.2
DRV84: Q73.1(G) R90.2
DRV85: Q74.1(G) R91.2
DRV86: Q75.1(G) R92.2
DRV87: Q76.1(G) R93.2
DRV88: Q81.1(G) R143.2
DRV89: Q82.1(G) R144.2
DRV90: Q83.1(G) R145.2
DRV91: Q84.1(G) R146.2
DRV92: Q85.1(G) R147.2
DRV93: Q86.1(G) R148.2
DRV94: Q87.1(G) R149.2
DRV95: Q88.1(G) R150.2
DRV96: Q89.1(G) R151.2
DRV97: Q90.1(G) R152.2
DRV98: Q91.1(G) R153.2
DRV99: Q92.1(G) R154.2
DRV100: Q93.1(G) R155.2
DRV101: Q94.1(G) R156.2
DRV102: Q95.1(G) R157.2
DRV103: Q96.1(G) R158.2
NetK28_2: K28.2(-) Q28.3(D)
NetK28_3: K28.3(CA) X30.1
NetK28_4: K28.4(CB) X28.1
NetK29_2: K29.2(-) Q31.3(D)
NetK29_3: K29.3(CA) X30.2
NetK29_4: K29.4(CB) X28.2
NetK30_2: K30.2(-) Q32.3(D)
NetK30_3: K30.3(CA) X30.3
NetK30_4: K30.4(CB) X28.3
NetK31_2: K31.2(-) Q33.3(D)
NetK31_3: K31.3(CA) X30.4
NetK31_4: K31.4(CB) X28.4
NetK32_2: K32.2(-) Q34.3(D)
NetK32_3: K32.3(CA) X30.5
NetK32_4: K32.4(CB) X28.5
NetK33_2: K33.2(-) Q35.3(D)
NetK33_3: K33.3(CA) X30.6
NetK33_4: K33.4(CB) X28.6
NetK34_2: K34.2(-) Q36.3(D)
NetK34_3: K34.3(CA) X30.7
NetK34_4: K34.4(CB) X28.7
NetK35_2: K35.2(-) Q37.3(D)
NetK35_3: K35.3(CA) X30.8
NetK35_4: K35.4(CB) X28.8
NetK36_2: K36.2(-) Q38.3(D)
NetK36_3: K36.3(CA) X30.9
NetK36_4: K36.4(CB) X28.9
NetK37_2: K37.2(-) Q39.3(D)
NetK37_3: K37.3(CA) X30.10
NetK37_4: K37.4(CB) X28.10
NetK38_2: K38.2(-) Q40.3(D)
NetK38_3: K38.3(CA) X30.11
NetK38_4: K38.4(CB) X28.11
NetK39_2: K39.2(-) Q41.3(D)
NetK39_3: K39.3(CA) X30.12
NetK39_4: K39.4(CB) X28.12
NetK40_2: K40.2(-) Q42.3(D)
NetK40_3: K40.3(CA) X30.13
NetK40_4: K40.4(CB) X28.13
NetK41_2: K41.2(-) Q43.3(D)
NetK41_3: K41.3(CA) X30.14
NetK41_4: K41.4(CB) X28.14
NetK42_2: K42.2(-) Q44.3(D)
NetK42_3: K42.3(CA) X30.15
NetK42_4: K42.4(CB) X28.15
NetK43_2: K43.2(-) Q45.3(D)
NetK43_3: K43.3(CA) X30.16
NetK43_4: K43.4(CB) X28.16
NetK44_2: K44.2(-) Q27.3(D)
NetK44_3: K44.3(CA) X30.17
NetK44_4: K44.4(CB) X28.17
NetK45_2: K45.2(-) Q46.3(D)
NetK45_3: K45.3(CA) X30.18
NetK45_4: K45.4(CB) X28.18
NetK46_2: K46.2(-) Q47.3(D)
NetK46_3: K46.3(CA) X30.19
NetK46_4: K46.4(CB) X28.19
NetK47_2: K47.2(-) Q48.3(D)
NetK47_3: K47.3(CA) X30.20
NetK47_4: K47.4(CB) X28.20
NetK48_2: K48.2(-) Q49.3(D)
NetK48_3: K48.3(CA) X30.21
NetK48_4: K48.4(CB) X28.21
NetK49_2: K49.2(-) Q50.3(D)
NetK49_3: K49.3(CA) X30.22
NetK49_4: K49.4(CB) X28.22
NetK50_2: K50.2(-) Q51.3(D)
NetK50_3: K50.3(CA) X30.23
NetK50_4: K50.4(CB) X28.23
NetK51_2: K51.2(-) Q52.3(D)
NetK51_3: K51.3(CA) X30.24
NetK51_4: K51.4(CB) X28.24
NetK52_2: K52.2(-) Q53.3(D)
NetK52_3: K52.3(CA) X30.25
NetK52_4: K52.4(CB) X28.25
NetK53_2: K53.2(-) Q54.3(D)
NetK53_3: K53.3(CA) X30.26
NetK53_4: K53.4(CB) X28.26
NetK54_2: K54.2(-) Q55.3(D)
NetK54_3: K54.3(CA) X30.27
NetK54_4: K54.4(CB) X28.27
NetK55_2: K55.2(-) Q56.3(D)
NetK55_3: K55.3(CA) X30.28
NetK55_4: K55.4(CB) X28.28
NetK56_2: K56.2(-) Q57.3(D)
NetK56_3: K56.3(CA) X30.29
NetK56_4: K56.4(CB) X28.29
NetK57_2: K57.2(-) Q58.3(D)
NetK57_3: K57.3(CA) X30.30
NetK57_4: K57.4(CB) X28.30
NetK58_2: K58.2(-) Q59.3(D)
NetK58_3: K58.3(CA) X30.31
NetK58_4: K58.4(CB) X28.31
NetK59_2: K59.2(-) Q60.3(D)
NetK59_3: K59.3(CA) X30.32
NetK59_4: K59.4(CB) X28.32
NetK60_2: K60.2(-) Q61.3(D)
NetK60_3: K60.3(CA) X30.33
NetK60_4: K60.4(CB) X28.33
NetK61_2: K61.2(-) Q62.3(D)
NetK61_3: K61.3(CA) X30.34
NetK61_4: K61.4(CB) X28.34
NetK62_2: K62.2(-) Q63.3(D)
NetK62_3: K62.3(CA) X30.35
NetK62_4: K62.4(CB) X28.35
NetK63_2: K63.2(-) Q64.3(D)
NetK63_3: K63.3(CA) X30.36
NetK63_4: K63.4(CB) X28.36
NetK64_2: K64.2(-) Q65.3(D)
NetK64_3: K64.3(CA) X30.37
NetK64_4: K64.4(CB) X28.37
NetK65_2: K65.2(-) Q66.3(D)
NetK65_3: K65.3(CA) X30.38
NetK65_4: K65.4(CB) X28.38
NetK66_2: K66.2(-) Q67.3(D)
NetK66_3: K66.3(CA) X30.39
NetK66_4: K66.4(CB) X28.39
NetK67_2: K67.2(-) Q68.3(D)
NetK67_3: K67.3(CA) X30.40
NetK67_4: K67.4(CB) X28.40
NetK68_2: K68.2(-) Q69.3(D)
NetK68_3: K68.3(CA) X30.41
NetK68_4: K68.4(CB) X28.41
NetK69_2: K69.2(-) Q70.3(D)
NetK69_3: K69.3(CA) X30.42
NetK69_4: K69.4(CB) X28.42
NetK70_2: K70.2(-) Q71.3(D)
NetK70_3: K70.3(CA) X30.43
NetK70_4: K70.4(CB) X28.43
NetK71_2: K71.2(-) Q72.3(D)
NetK71_3: K71.3(CA) X30.44
NetK71_4: K71.4(CB) X28.44
NetK72_2: K72.2(-) Q73.3(D)
NetK72_3: K72.3(CA) X30.45
NetK72_4: K72.4(CB) X28.45
NetK73_2: K73.2(-) Q74.3(D)
NetK73_3: K73.3(CA) X30.46
NetK73_4: K73.4(CB) X28.46
NetK74_2: K74.2(-) Q75.3(D)
NetK74_3: K74.3(CA) X30.47
NetK74_4: K74.4(CB) X28.47
NetK75_2: K75.2(-) Q76.3(D)
NetK75_3: K75.3(CA) X30.48
NetK75_4: K75.4(CB) X28.48
NetK76_2: K76.2(-) Q81.3(D)
NetK76_3: K76.3(CA) X30.49
NetK76_4: K76.4(CB) X28.49
NetK77_2: K77.2(-) Q82.3(D)
NetK77_3: K77.3(CA) X30.50
NetK77_4: K77.4(CB) X28.50
NetK78_2: K78.2(-) Q83.3(D)
NetK78_3: K78.3(CA) X30.51
NetK78_4: K78.4(CB) X28.51
NetK79_2: K79.2(-) Q84.3(D)
NetK79_3: K79.3(CA) X30.52
NetK79_4: K79.4(CB) X28.52
NetK80_2: K80.2(-) Q85.3(D)
NetK80_3: K80.3(CA) X30.53
NetK80_4: K80.4(CB) X28.53
NetK81_2: K81.2(-) Q86.3(D)
NetK81_3: K81.3(CA) X30.54
NetK81_4: K81.4(CB) X28.54
NetK82_2: K82.2(-) Q87.3(D)
NetK82_3: K82.3(CA) X30.55
NetK82_4: K82.4(CB) X28.55
NetK83_2: K83.2(-) Q88.3(D)
NetK83_3: K83.3(CA) X30.56
NetK83_4: K83.4(CB) X28.56
NetK84_2: K84.2(-) Q89.3(D)
NetK84_3: K84.3(CA) X30.57
NetK84_4: K84.4(CB) X28.57
NetK85_2: K85.2(-) Q90.3(D)
NetK85_3: K85.3(CA) X30.58
NetK85_4: K85.4(CB) X28.58
NetK86_2: K86.2(-) Q91.3(D)
NetK86_3: K86.3(CA) X30.59
NetK86_4: K86.4(CB) X28.59
NetK87_2: K87.2(-) Q92.3(D)
NetK87_3: K87.3(CA) X30.60
NetK87_4: K87.4(CB) X28.60
NetK88_2: K88.2(-) Q93.3(D)
NetK88_3: K88.3(CA) X30.61
NetK88_4: K88.4(CB) X28.61
NetK89_2: K89.2(-) Q94.3(D)
NetK89_3: K89.3(CA) X30.62
NetK89_4: K89.4(CB) X28.62
NetK90_2: K90.2(-) Q95.3(D)
NetK90_3: K90.3(CA) X30.63
NetK90_4: K90.4(CB) X28.63
NetK91_2: K91.2(-) Q96.3(D)
NetK91_3: K91.3(CA) X30.64
NetK91_4: K91.4(CB) X28.64

### Buses and harness runs
bus ABUS[7..0] = port ABUS[7..0]
bus DRV[103..1] = port DRV[103..1]

### Layout directives
net class ABUS: ABUS0, ABUS1, ABUS2, ABUS3, ABUS4, ABUS5, ABUS6, ABUS7, ABUS[7..0]

### Notes on the sheet
- designed by
- reviewed by
- last drawn by
- Schematic:
- Project:
- last printed
- DIN-A3 P
- sheets
- of
- File:

### Library data of the parts
K28-K91 = 118-1-A-5/2D: 5V Signal Relais, Normal Open; 04. Manufacturer: Pickering; 03. Unit Price: 2.60; 05. Quantity: 1000; 06. Data Sheet: Pickering_series_118.pdf; 13. Created Date/Name: 20.12.17 S. Kaiser; Coil Resistance: 1500 Ohm; Max Carry Current: 1.2 A; Max Switch Current: 1A; Max Switch Voltage: 200V; Power Rating: 15W; 01. Distributor: Pickering; 02. Distributor Part Number: 118-1-A-5/2D; 07. Manufacturer  Part Number: 118-1-A-5/2D; 09. Operating Temperature: -20°C ~ +85°C; 11. RoHS: 2011/65/EU; ComponentLink1Description: Info; ComponentLink1URL: http://www.pickeringrelay.com/; ComponentLink2Description: DataSheet; ComponentLink2URL: https://www.pickeringrelay.com/products/single-line-sil-series-111-119/single-line-sil-series-118/; Coil Voltage: 5V
Q27 Q28 Q31-Q76 Q81-Q96 = FDV303N: as Q11-Q26 on sheet PowerRouting; 01. Distributor: DigiKey; 02. Distributor Part Number: FDV303NDKR-ND; 07. Manufacturer  Part Number: FDV303N; 09. Operating Temperature: -55°C ~ 150°C (TJ); 11. RoHS: YES; ComponentLink1Description: Info; ComponentLink1URL: https://www.digikey.de/product-detail/en/on-semiconductor/FDV303N/FDV303NDKR-ND/1630434; ComponentLink2Description: DataSheet; ComponentLink2URL: https://media.digikey.com/pdf/Data%20Sheets/Fairchild%20PDFs/FDV303N.pdf; Vdss: 25V; Id: 680mA
R32 R33 R48-R93 R143-R158 = R: as R16-R31 on sheet PowerRouting; Tolerance: ±1%; ComponentLink1URL: *; ComponentLink1Description: Info; 02. Distributor Part Number: 311-4.70KHRCT-ND; 09. Operating Temperature: -xx..+yy°C; 11. RoHS: ???; 01. Distributor: DigiKey; ComponentLink2Description: DataSheet; Package: *
X28 = TFC-132-01-F-D-LA: CONN HEADER TH RA 48POS 1.27MM; 04. Manufacturer: Samtec Inc.; 03. Unit Price: 5; 13. Created Date/Name: ??? / Hören; System: Connector; 01. Distributor: Samtec Inc.; 02. Distributor Part Number: TFC-132-01-F-D-LA; 07. Manufacturer  Part Number: TFC-132-01-F-D-LA; 11. RoHS: YES; ComponentLink1Description: Info; ComponentLink1URL: https://www.samtec.com/products/tfc-124-01-f-d-ra; ComponentLink2Description: DataSheet
X29 = SFSD-32-30C-G-15.00-S: 32 x 2 x 1.27mm SOCKET DISCRETE CABL COLORED; 04. Manufacturer: Samtec Inc.; 03. Unit Price: 10; 13. Created Date/Name: ??? / Hören; 01. Distributor: Samtec Inc.; 02. Distributor Part Number: SFSD-32-30C-G-15.00-S; 07. Manufacturer  Part Number: SFSD-32-30C-G-15.00-S; 11. RoHS: YES; ComponentLink1Description: Info; ComponentLink1URL: https://www.samtec.com/products/sfsd-24-30c-g-15.00-s; ComponentLink2Description: DataSheet
X30 = CONFIG64: PCB Tester Configuration Matrix for 64 Relays over 8 ABUSes; 13. Created Date/Name: ??? / Hören; ComponentLink1Description: Info; ComponentLink2Description: DataSheet

## Nets that join several sheets
1V0: PSU2 (C66.1 J5.2 J6.2), X7A15T-Power (16 pins), X7A15T-Decoupling (10 pins)
1V8: PSU2 (C67.1 J7.2 J8.2), RelayDriver (C9.1 L1.1), X7A15T-Power (U7.F12 U7.H12 U7.K12 U7.M12), X7A15T-Decoupling (7 pins)
1V8A: RelayDriver (C10.1 L1.2), X7A15T-Power (U7.H10), X7A15T-Decoupling (C471.1)
3V3: PSU2 (C69.1 J11.2 J12.2), X7A15T-Prog (15 pins), X7A15T-Fabric (9 pins), X7A15T-Power (26 pins), X7A15T-Decoupling (34 pins)
3V3RPI: RE2 (X3_1.A18), Controller (19 pins), ADC (5 pins), X7A15T-Fabric (C77.1 U11.14), Controller/Input (R166_1.2), Controller/Input (R166_2.2), Controller/Input (R166_3.2), Controller/Input (R166_4.2), Controller/Input (R166_5.2), RE3 (X3_2.A18 X3_2.B18), RE4 (X3_3.B17), RE5 (X3_4.B17 X3_4.B18), RE6 (X3_5.A18 X3_5.B17), RE7 (X3_6.A18 X3_6.B17 X3_6.B18), RE8 (X3_7.A17), RE1 (X3_8.B18), RE9 (X3_9.A17 X3_9.B18)
5V0: PSU2 (12 pins), PSU3 (D31.1 TP10.1 U10.3), Controller (X1.2 X1.4), ADC (C4.1 U1.5)
5V0R: Instrument1 (K1_1.1), Instrument2 (K1_2.1), Instrument3 (K1_3.1), Instrument4 (K1_4.1), Instrument5 (K1_5.1), Instrument6 (K1_6.1), Instrument7 (K1_7.1), Instrument8 (K1_8.1), PSU3 (6 pins), RE2 (8 pins), ADC (10 pins), RE3 (8 pins), RE4 (8 pins), RE5 (8 pins), RE6 (8 pins), RE7 (8 pins), RE8 (8 pins), RE1 (8 pins), RE9 (8 pins), PowerRouting (32 pins), SignalRouting (64 pins)
12V0: Power (J2.1), PSU2 (19 pins), PSU1 (A2.8 C13.1 C39.1 TP5.1), PSU3 (F2.1), RE2 (X3_1.A11 X3_1.A12 X3_1.B11 X3_1.B12), Controller (J14.1), ADC (C5.1 U5.4), RE3 (X3_2.A11 X3_2.A12 X3_2.B11 X3_2.B12), RE4 (X3_3.A11 X3_3.A12 X3_3.B11 X3_3.B12), RE5 (X3_4.A11 X3_4.A12 X3_4.B11 X3_4.B12), RE6 (X3_5.A11 X3_5.A12 X3_5.B11 X3_5.B12), RE7 (X3_6.A11 X3_6.A12 X3_6.B11 X3_6.B12), RE8 (X3_7.A11 X3_7.A12 X3_7.B11 X3_7.B12), RE1 (X3_8.A11 X3_8.A12 X3_8.B11 X3_8.B12), RE9 (X3_9.A11 X3_9.A12 X3_9.B11 X3_9.B12)
24V0: Power (TP3.1 X2.1 X2.2 X2.3), PSU1 (F1.1), Controller/Input (X31_1.1), Controller/Output (D3_1.3 X33_1.1), Controller/Output (D3_2.3 X33_2.1), Controller/Output (D3_3.3 X33_3.1), Controller/Output (D3_4.3 X33_4.1), Controller/Output (D3_5.3 X33_5.1), Controller/Input (X31_2.1), Controller/Input (X31_3.1), Controller/Input (X31_4.1), Controller/Input (X31_5.1)
GND: PCB-Tester-Board-V1 (12 pins), Instrument1 (BNC1_1.0 Q77_1.2 R1_1.1), Instrument2 (BNC1_2.0 Q77_2.2 R1_2.1), Instrument3 (BNC1_3.0 Q77_3.2 R1_3.1), Instrument4 (BNC1_4.0 Q77_4.2 R1_4.1), Instrument5 (BNC1_5.0 Q77_5.2 R1_5.1), Instrument6 (BNC1_6.0 Q77_6.2 R1_6.1), Instrument7 (BNC1_7.0 Q77_7.2 R1_7.1), Instrument8 (BNC1_8.0 Q77_8.2 R1_8.1), Power (TP3.2 X2.4 X2.5 X2.6), PSU2 (66 pins), PSU1 (10 pins), PSU3 (16 pins), RE2 (11 pins), Controller (25 pins), ADC (37 pins), RelayDriver (C9.2 C10.2), X7A15T-Prog (26 pins), X7A15T-Fabric (14 pins), X7A15T-Power (49 pins), X7A15T-Decoupling (54 pins), Controller/Input (Q97_1.2 R117_1.1), Controller/Output (Q29_1.2 R38_1.1), Controller/Output (Q29_2.2 R38_2.1), Controller/Output (Q29_3.2 R38_3.1), Controller/Output (Q29_4.2 R38_4.1), Controller/Output (Q29_5.2 R38_5.1), Controller/Input (Q97_2.2 R117_2.1), Controller/Input (Q97_3.2 R117_3.1), Controller/Input (Q97_4.2 R117_4.1), Controller/Input (Q97_5.2 R117_5.1), RE3 (10 pins), RE4 (11 pins), RE5 (10 pins), RE6 (10 pins), RE7 (9 pins), RE8 (11 pins), RE1 (11 pins), RE9 (10 pins), PowerRouting (32 pins), SignalRouting (128 pins)
~{CS0}: Controller (R10.1 X1.22), ADC (U2.6)
~{CS1}: Controller (R11.1 X1.33), X7A15T-Fabric (5 pins)
~{CS2}: Controller (R34.1 X1.8), RE1 (X3_8.B15)
~{CS3}: RE2 (X3_1.B15), Controller (R35.1 X1.10)
~{CS4}: Controller (R36.1 X1.12), RE3 (X3_2.B15)
~{CS5}: Controller (R37.1 X1.16), RE4 (X3_3.B15)
~{CS6}: Controller (R98.1 X1.18), RE5 (X3_4.B15)
~{CS7}: Controller (R100.1 X1.24), RE6 (X3_5.B15)
~{CS8}: Controller (R102.1 X1.26), RE7 (X3_6.B15)
~{CS9}: Controller (R104.1 X1.29), RE8 (X3_7.B15)
~{CS10}: Controller (R106.1 X1.31), RE9 (X3_9.B15)
ABUS0: Instrument1 (K1_1.4), RE2 (X3_1.A5), ADC (K2.4), RE3 (X3_2.A5), RE4 (X3_3.A5), RE5 (X3_4.A5), RE6 (X3_5.A5), RE7 (X3_6.A5), RE8 (X3_7.A5), RE1 (X3_8.A5), RE9 (X3_9.A5), SignalRouting (X30.ABUS0)
ABUS1: Instrument2 (K1_2.4), RE2 (X3_1.B5), ADC (K3.4), RE3 (X3_2.B5), RE4 (X3_3.B5), RE5 (X3_4.B5), RE6 (X3_5.B5), RE7 (X3_6.B5), RE8 (X3_7.B5), RE1 (X3_8.B5), RE9 (X3_9.B5), SignalRouting (X30.ABUS1)
ABUS2: Instrument3 (K1_3.4), RE2 (X3_1.A4), ADC (K4.4), RE3 (X3_2.A4), RE4 (X3_3.A4), RE5 (X3_4.A4), RE6 (X3_5.A4), RE7 (X3_6.A4), RE8 (X3_7.A4), RE1 (X3_8.A4), RE9 (X3_9.A4), SignalRouting (X30.ABUS2)
ABUS3: Instrument4 (K1_4.4), RE2 (X3_1.B4), ADC (K5.4), RE3 (X3_2.B4), RE4 (X3_3.B4), RE5 (X3_4.B4), RE6 (X3_5.B4), RE7 (X3_6.B4), RE8 (X3_7.B4), RE1 (X3_8.B4), RE9 (X3_9.B4), SignalRouting (X30.ABUS3)
ABUS4: Instrument5 (K1_5.4), RE2 (X3_1.A3), ADC (K6.4), RE3 (X3_2.A3), RE4 (X3_3.A3), RE5 (X3_4.A3), RE6 (X3_5.A3), RE7 (X3_6.A3), RE8 (X3_7.A3), RE1 (X3_8.A3), RE9 (X3_9.A3), SignalRouting (X30.ABUS4)
ABUS5: Instrument6 (K1_6.4), RE2 (X3_1.B3), ADC (K7.4), RE3 (X3_2.B3), RE4 (X3_3.B3), RE5 (X3_4.B3), RE6 (X3_5.B3), RE7 (X3_6.B3), RE8 (X3_7.B3), RE1 (X3_8.B3), RE9 (X3_9.B3), SignalRouting (X30.ABUS5)
ABUS6: Instrument7 (K1_7.4), RE2 (X3_1.A2), ADC (K8.4), RE3 (X3_2.A2), RE4 (X3_3.A2), RE5 (X3_4.A2), RE6 (X3_5.A2), RE7 (X3_6.A2), RE8 (X3_7.A2), RE1 (X3_8.A2), RE9 (X3_9.A2), SignalRouting (X30.ABUS6)
ABUS7: Instrument8 (K1_8.4), RE2 (X3_1.B2), ADC (K9.4), RE3 (X3_2.B2), RE4 (X3_3.B2), RE5 (X3_4.B2), RE6 (X3_5.B2), RE7 (X3_6.B2), RE8 (X3_7.B2), RE1 (X3_8.B2), RE9 (X3_9.B2), SignalRouting (X30.ABUS7)
DRV1: ADC (Q1.1 R2.2), X7A15T-Fabric (U7.T9)
DRV2: ADC (Q2.1 R3.2), X7A15T-Fabric (U7.P15)
DRV3: ADC (Q3.1 R4.2), X7A15T-Fabric (U7.T13)
DRV4: ADC (Q4.1 R5.2), X7A15T-Fabric (U7.R17)
DRV5: ADC (Q5.1 R6.2), X7A15T-Fabric (U7.R10)
DRV6: ADC (Q6.1 R7.2), X7A15T-Fabric (U7.T15)
DRV7: ADC (Q7.1 R8.2), X7A15T-Fabric (U7.T10)
DRV8: ADC (Q8.1 R9.2), X7A15T-Fabric (U7.R15)
DRV9: ADC (Q9.1 R14.2), X7A15T-Fabric (U7.U13)
DRV10: ADC (Q10.1 R15.2), X7A15T-Fabric (U7.P18)
DRV11: X7A15T-Fabric (U7.B17), Controller/Output (Q29_1.1 R38_1.2)
DRV12: X7A15T-Fabric (U7.A18), Controller/Output (Q29_2.1 R38_2.2)
DRV13: X7A15T-Fabric (U7.B18), Controller/Output (Q29_3.1 R38_3.2)
DRV14: X7A15T-Fabric (U7.C17), Controller/Output (Q29_4.1 R38_4.2)
DRV15: X7A15T-Fabric (U7.D18), Controller/Output (Q29_5.1 R38_5.2)
DRV16: Instrument1 (Q77_1.1 R1_1.2), X7A15T-Fabric (U7.P2)
DRV17: Instrument2 (Q77_2.1 R1_2.2), X7A15T-Fabric (U7.P3)
DRV18: Instrument3 (Q77_3.1 R1_3.2), X7A15T-Fabric (U7.P4)
DRV19: Instrument4 (Q77_4.1 R1_4.2), X7A15T-Fabric (U7.P5)
DRV20: Instrument5 (Q77_5.1 R1_5.2), X7A15T-Fabric (U7.U4)
DRV21: Instrument6 (Q77_6.1 R1_6.2), X7A15T-Fabric (U7.T5)
DRV22: Instrument7 (Q77_7.1 R1_7.2), X7A15T-Fabric (U7.T8)
DRV23: Instrument8 (Q77_8.1 R1_8.2), X7A15T-Fabric (U7.U18)
DRV24: X7A15T-Fabric (U7.C4), PowerRouting (Q12.1 R17.2)
DRV25: X7A15T-Fabric (U7.C5), PowerRouting (Q13.1 R18.2)
DRV26: X7A15T-Fabric (U7.C6), PowerRouting (Q14.1 R19.2)
DRV27: X7A15T-Fabric (U7.C7), PowerRouting (Q15.1 R20.2)
DRV28: X7A15T-Fabric (U7.D7), PowerRouting (Q16.1 R21.2)
DRV29: X7A15T-Fabric (U7.D8), PowerRouting (Q17.1 R22.2)
DRV30: X7A15T-Fabric (U7.E7), PowerRouting (Q18.1 R23.2)
DRV31: X7A15T-Fabric (U7.D13), PowerRouting (Q19.1 R24.2)
DRV32: X7A15T-Fabric (U7.D14), PowerRouting (Q20.1 R25.2)
DRV33: X7A15T-Fabric (U7.C15), PowerRouting (Q21.1 R26.2)
DRV34: X7A15T-Fabric (U7.D15), PowerRouting (Q22.1 R27.2)
DRV35: X7A15T-Fabric (U7.E15), PowerRouting (Q23.1 R28.2)
DRV36: X7A15T-Fabric (U7.E18), PowerRouting (Q24.1 R29.2)
DRV37: X7A15T-Fabric (U7.F18), PowerRouting (Q25.1 R30.2)
DRV38: X7A15T-Fabric (U7.G18), PowerRouting (Q26.1 R31.2)
DRV39: X7A15T-Fabric (U7.J18), PowerRouting (Q11.1 R16.2)
DRV40: X7A15T-Fabric (U7.V15), SignalRouting (Q28.1 R33.2)
DRV41: X7A15T-Fabric (U7.V16), SignalRouting (Q31.1 R48.2)
DRV42: X7A15T-Fabric (U7.U16), SignalRouting (Q32.1 R49.2)
DRV43: X7A15T-Fabric (U7.V17), SignalRouting (Q33.1 R50.2)
DRV44: X7A15T-Fabric (U7.V12), SignalRouting (Q34.1 R51.2)
DRV45: X7A15T-Fabric (U7.U12), SignalRouting (Q35.1 R52.2)
DRV46: X7A15T-Fabric (U7.V14), SignalRouting (Q36.1 R53.2)
DRV47: X7A15T-Fabric (U7.U14), SignalRouting (Q37.1 R54.2)
DRV48: X7A15T-Fabric (U7.U9), SignalRouting (Q38.1 R55.2)
DRV49: X7A15T-Fabric (U7.V10), SignalRouting (Q39.1 R56.2)
DRV50: X7A15T-Fabric (U7.V11), SignalRouting (Q40.1 R57.2)
DRV51: X7A15T-Fabric (U7.U11), SignalRouting (Q41.1 R58.2)
DRV52: X7A15T-Fabric (U7.U7), SignalRouting (Q42.1 R59.2)
DRV53: X7A15T-Fabric (U7.V7), SignalRouting (Q43.1 R60.2)
DRV54: X7A15T-Fabric (U7.U8), SignalRouting (Q44.1 R61.2)
DRV55: X7A15T-Fabric (U7.V9), SignalRouting (Q45.1 R62.2)
DRV56: X7A15T-Fabric (U7.V4), SignalRouting (Q27.1 R32.2)
DRV57: X7A15T-Fabric (U7.V5), SignalRouting (Q46.1 R63.2)
DRV58: X7A15T-Fabric (U7.U6), SignalRouting (Q47.1 R64.2)
DRV59: X7A15T-Fabric (U7.V6), SignalRouting (Q48.1 R65.2)
DRV60: X7A15T-Fabric (U7.U2), SignalRouting (Q49.1 R66.2)
DRV61: X7A15T-Fabric (U7.V1), SignalRouting (Q50.1 R67.2)
DRV62: X7A15T-Fabric (U7.V2), SignalRouting (Q51.1 R68.2)
DRV63: X7A15T-Fabric (U7.U3), SignalRouting (Q52.1 R69.2)
DRV64: X7A15T-Fabric (U7.R1), SignalRouting (Q53.1 R70.2)
DRV65: X7A15T-Fabric (U7.R2), SignalRouting (Q54.1 R71.2)
DRV66: X7A15T-Fabric (U7.T1), SignalRouting (Q55.1 R72.2)
DRV67: X7A15T-Fabric (U7.U1), SignalRouting (Q56.1 R73.2)
DRV68: X7A15T-Fabric (U7.M1), SignalRouting (Q57.1 R74.2)
DRV69: X7A15T-Fabric (U7.M2), SignalRouting (Q58.1 R75.2)
DRV70: X7A15T-Fabric (U7.N1), SignalRouting (Q59.1 R76.2)
DRV71: X7A15T-Fabric (U7.N2), SignalRouting (Q60.1 R77.2)
DRV72: X7A15T-Fabric (U7.J2), SignalRouting (Q61.1 R78.2)
DRV73: X7A15T-Fabric (U7.K1), SignalRouting (Q62.1 R79.2)
DRV74: X7A15T-Fabric (U7.K2), SignalRouting (Q63.1 R80.2)
DRV75: X7A15T-Fabric (U7.L1), SignalRouting (Q64.1 R81.2)
DRV76: X7A15T-Fabric (U7.G2), SignalRouting (Q65.1 R82.2)
DRV77: X7A15T-Fabric (U7.G1), SignalRouting (Q66.1 R83.2)
DRV78: X7A15T-Fabric (U7.H2), SignalRouting (Q67.1 R84.2)
DRV79: X7A15T-Fabric (U7.H1), SignalRouting (Q68.1 R85.2)
DRV80: X7A15T-Fabric (U7.C1), SignalRouting (Q69.1 R86.2)
DRV81: X7A15T-Fabric (U7.D2), SignalRouting (Q70.1 R87.2)
DRV82: X7A15T-Fabric (U7.E1), SignalRouting (Q71.1 R88.2)
DRV83: X7A15T-Fabric (U7.F1), SignalRouting (Q72.1 R89.2)
DRV84: X7A15T-Fabric (U7.A1), SignalRouting (Q73.1 R90.2)
DRV85: X7A15T-Fabric (U7.B2), SignalRouting (Q74.1 R91.2)
DRV86: X7A15T-Fabric (U7.B1), SignalRouting (Q75.1 R92.2)
DRV87: X7A15T-Fabric (U7.C2), SignalRouting (Q76.1 R93.2)
DRV88: X7A15T-Fabric (U7.A4), SignalRouting (Q81.1 R143.2)
DRV89: X7A15T-Fabric (U7.B4), SignalRouting (Q82.1 R144.2)
DRV90: X7A15T-Fabric (U7.A3), SignalRouting (Q83.1 R145.2)
DRV91: X7A15T-Fabric (U7.B3), SignalRouting (Q84.1 R146.2)
DRV92: X7A15T-Fabric (U7.B7), SignalRouting (Q85.1 R147.2)
DRV93: X7A15T-Fabric (U7.A6), SignalRouting (Q86.1 R148.2)
DRV94: X7A15T-Fabric (U7.B6), SignalRouting (Q87.1 R149.2)
DRV95: X7A15T-Fabric (U7.A5), SignalRouting (Q88.1 R150.2)
DRV96: X7A15T-Fabric (U7.B9), SignalRouting (Q89.1 R151.2)
DRV97: X7A15T-Fabric (U7.A9), SignalRouting (Q90.1 R152.2)
DRV98: X7A15T-Fabric (U7.B8), SignalRouting (Q91.1 R153.2)
DRV99: X7A15T-Fabric (U7.A8), SignalRouting (Q92.1 R154.2)
DRV100: X7A15T-Fabric (U7.A13), SignalRouting (Q93.1 R155.2)
DRV101: X7A15T-Fabric (U7.B12), SignalRouting (Q94.1 R156.2)
DRV102: X7A15T-Fabric (U7.A11), SignalRouting (Q95.1 R157.2)
DRV103: X7A15T-Fabric (U7.A10), SignalRouting (Q96.1 R158.2)
In1: Controller (X1.11), Controller/Input (Q97_1.3 R166_1.1)
In2: Controller (X1.13), Controller/Input (Q97_2.3 R166_2.1)
In3: Controller (X1.15), Controller/Input (Q97_3.3 R166_3.1)
In4: Controller (X1.35), Controller/Input (Q97_4.3 R166_4.1)
In5: Controller (X1.37), Controller/Input (Q97_5.3 R166_5.1)
MISO: RE2 (X3_1.A15), Controller (J4.3 X1.21), ADC (R115.2), X7A15T-Fabric (R118.1), RE3 (X3_2.A15), RE4 (X3_3.A15), RE5 (X3_4.A15), RE6 (X3_5.A15), RE7 (X3_6.A15), RE8 (X3_7.A15), RE1 (X3_8.A15), RE9 (X3_9.A15)
MOSI: RE2 (X3_1.A14), Controller (J4.2 R107.1), X7A15T-Fabric (U11.5), RE3 (X3_2.A14), RE4 (X3_3.A14), RE5 (X3_4.A14), RE6 (X3_5.A14), RE7 (X3_6.A14), RE8 (X3_7.A14), RE1 (X3_8.A14), RE9 (X3_9.A14)
NetC53_1: PSU2 (5 pins), Controller (J14.3 J15.1)
NetJ14_5: PSU2 (R127.1 U3.17), Controller (J14.5 J18.1)
NetJ14_7: PSU2 (R128.1 U3.18), Controller (J14.7 J17.1)
NetJ14_9: PSU2 (R129.1 U3.19), Controller (J14.9 J16.1)
P12V0D_S: Power (J2.2), PSU1 (A2.7)
SCLK: RE2 (X3_1.B14), Controller (J4.4 R108.1), ADC (U2.8), X7A15T-Fabric (U11.2), RE3 (X3_2.B14), RE4 (X3_3.B14), RE5 (X3_4.B14), RE6 (X3_5.B14), RE7 (X3_6.B14), RE8 (X3_7.B14), RE1 (X3_8.B14), RE9 (X3_9.B14)